# Altium schematic sheet Myproject.SchDoc
size A2; SheetNumber: 1; SheetTotal: 1
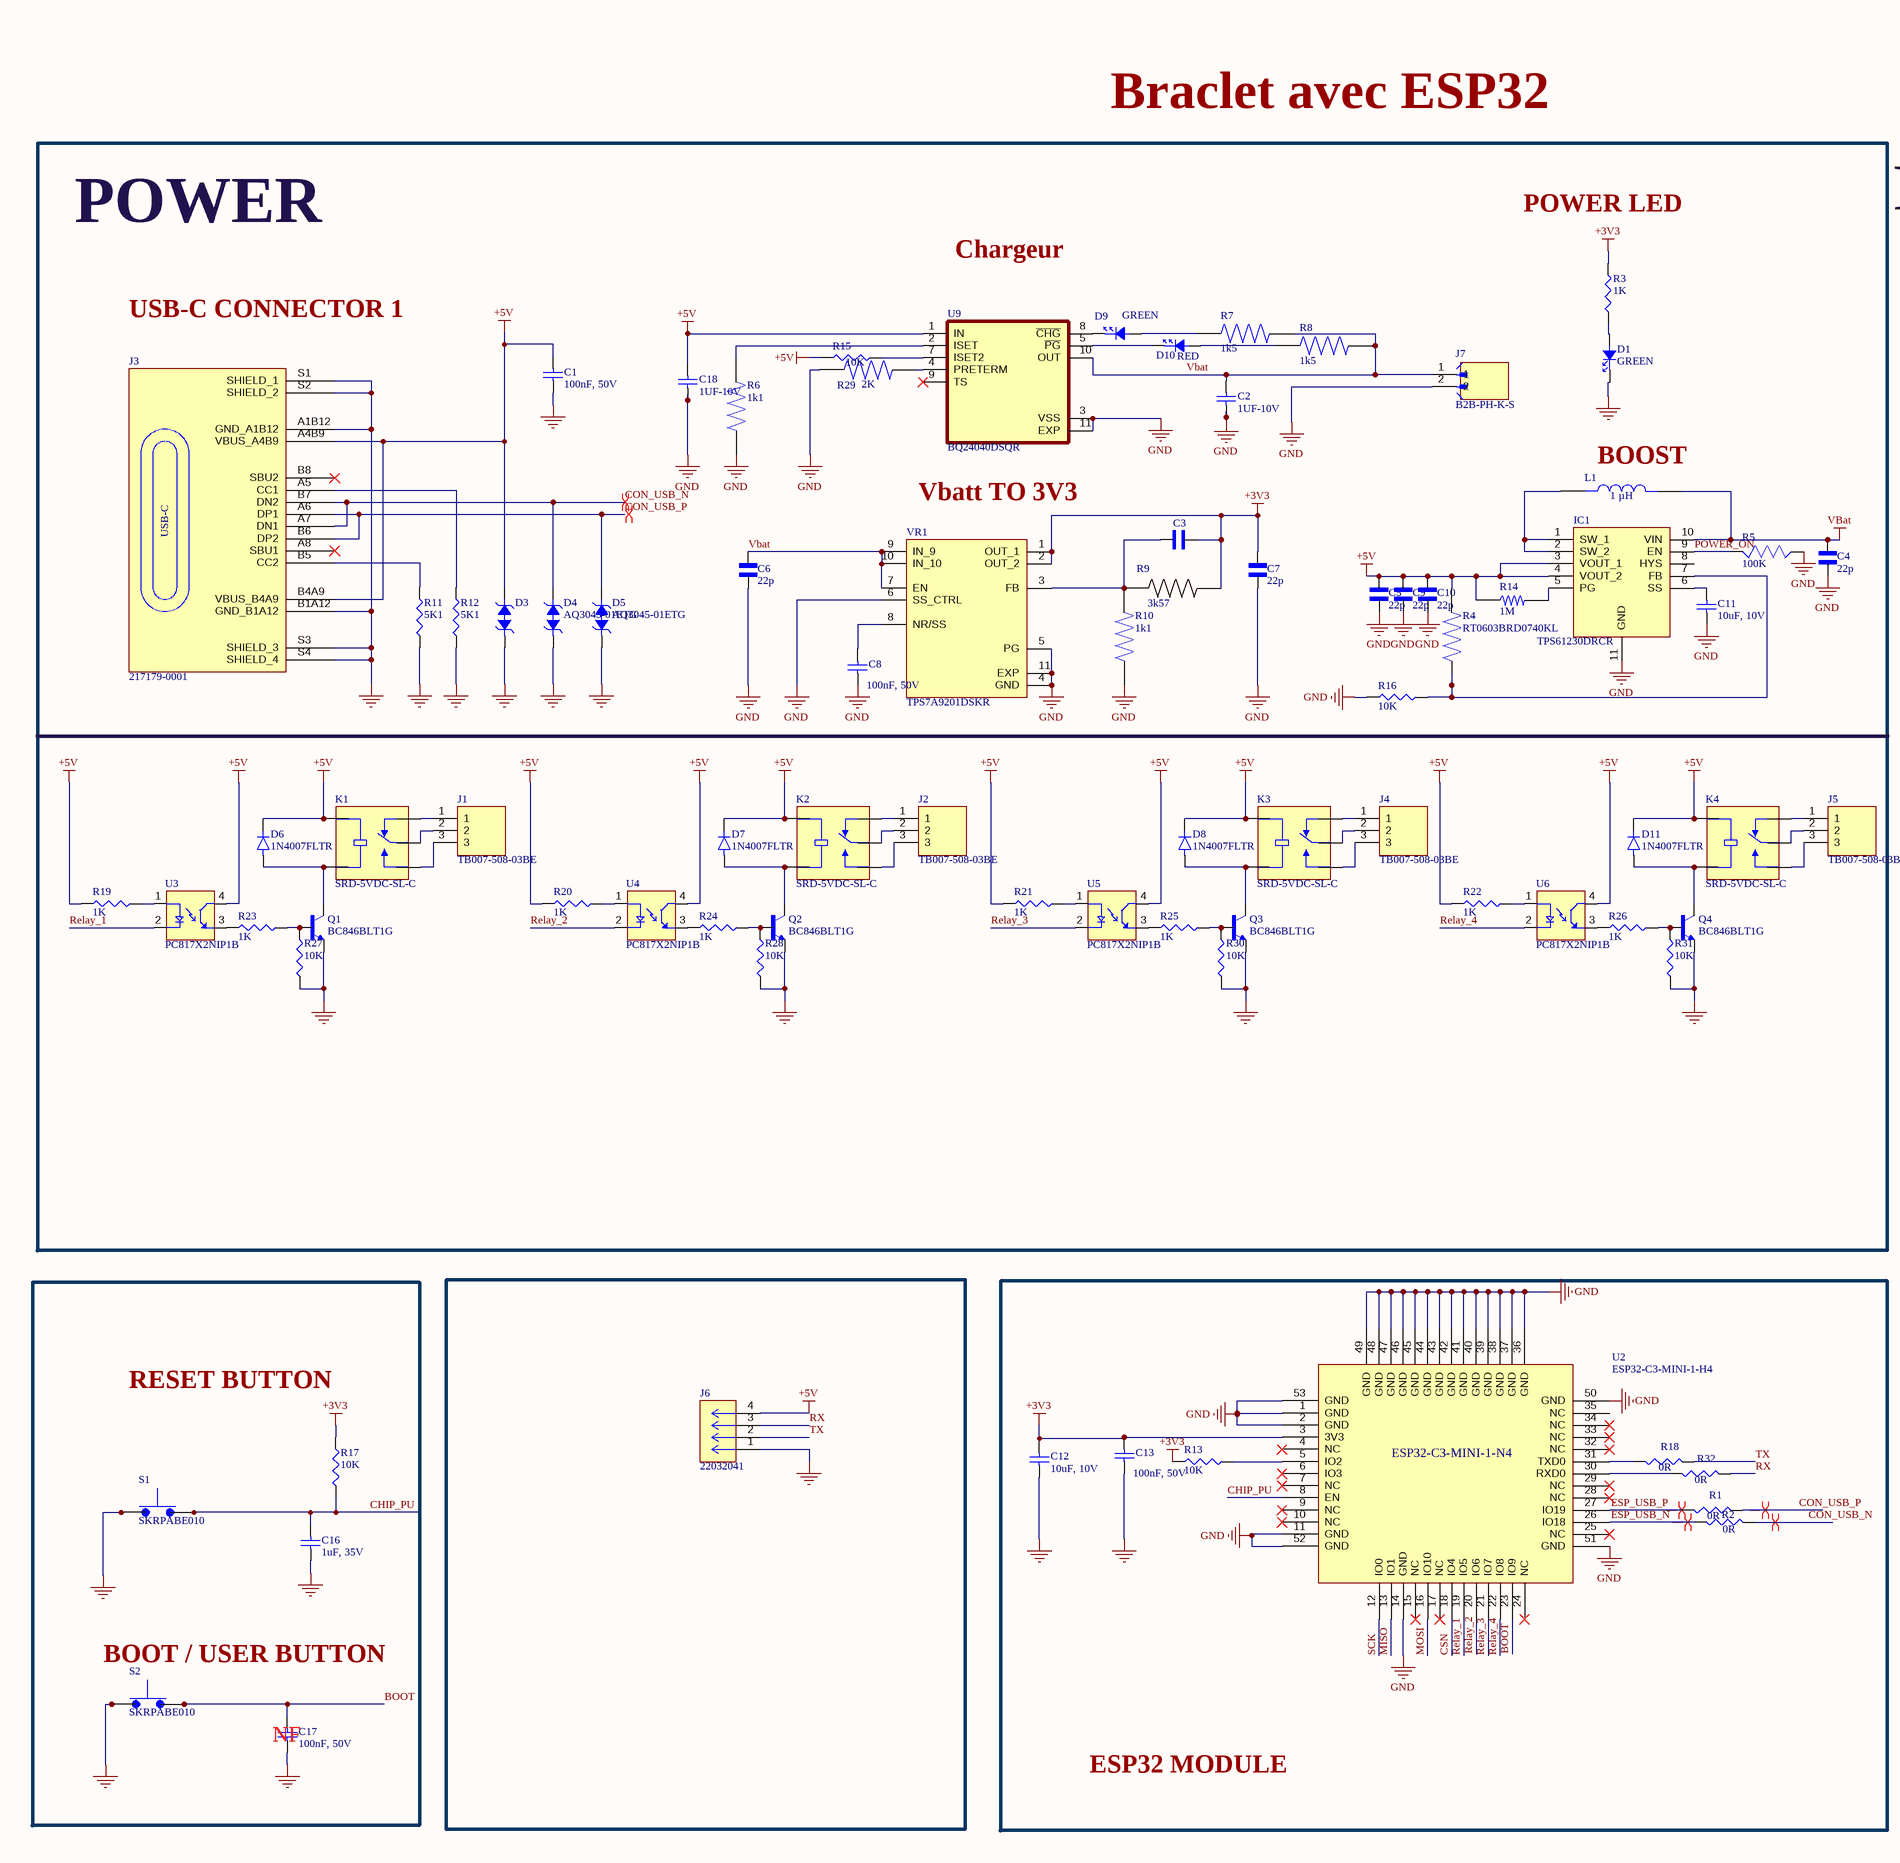
[diagram p0: Myproject.SchDoc, left]
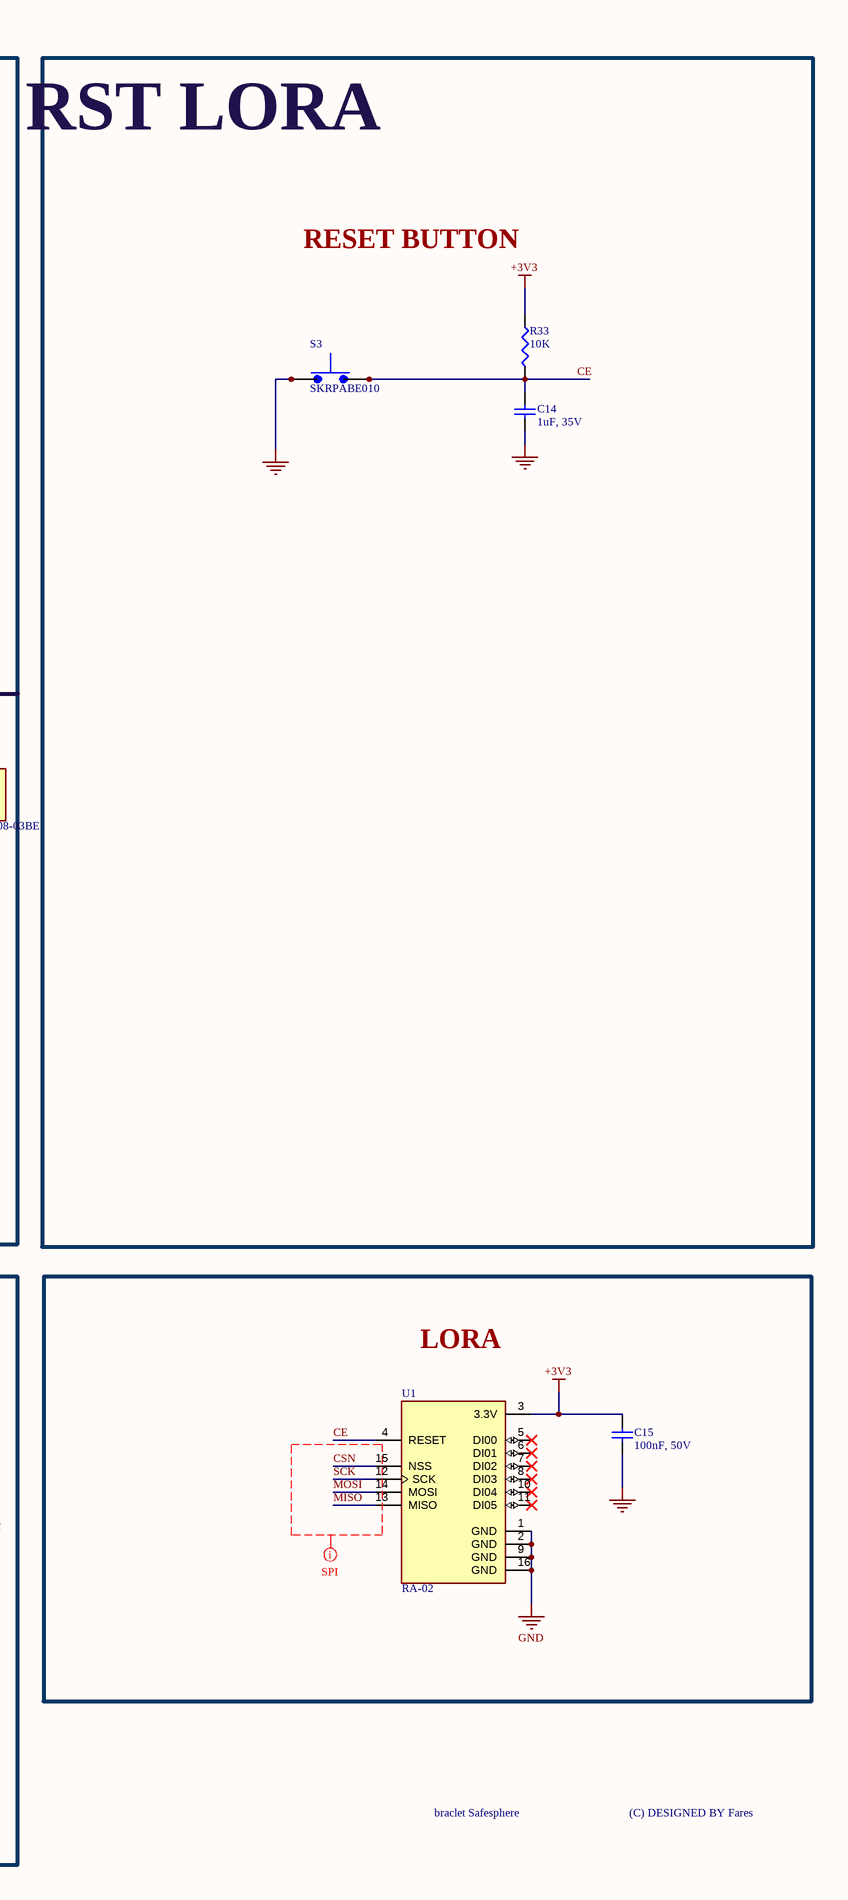
[diagram p1: Myproject.SchDoc, right]

## Parts
C1  100nF, 50V  [CAPC1005X55N]
C2  1UF-10V  [C0402]
C3  C0402C103K5REC7411  [CAPC1005X55N]  (value not drawn)
C4  value 22p  [CAPC1005X55N]  (hidden comment: CC0402JRNPO9BN220)
C5  value 22p  [CAPC1005X55N]  (hidden comment: CC0402JRNPO9BN220)
C6  value 22p  [CAPC1005X55N]  (hidden comment: CC0402JRNPO9BN220)
C7  value 22p  [CAPC1005X55N]  (hidden comment: CC0402JRNPO9BN220)
C8  100nF, 50V  [CAPC1005X55N]
C9  value 22p  [CAPC1005X55N]  (hidden comment: CC0402JRNPO9BN220)
C10  value 22p  [CAPC1005X55N]  (hidden comment: CC0402JRNPO9BN220)
C11  10uF, 10V  [CAPC1005X55N]
C12  10uF, 10V  [CAPC1005X55N]
C13  100nF, 50V  [CAPC1005X55N]
C14  1uF, 35V  [CAPC1005X55N]
C15  100nF, 50V  [CAPC1005X55N]
C16  1uF, 35V  [CAPC1005X55N]
C17  100nF, 50V  [CAPC1005X55N]
C18  1UF-10V  [C0402]
D1  GREEN  [LED0402G]
D3  AQ3045-01ETG  [SOD882]  (value not drawn)
D4  AQ3045-01ETG  [SOD882]
D5  AQ3045-01ETG  [SOD882]
D6  1N4007FLTR  [SODFL3618X110N]
D7  1N4007FLTR  [SODFL3618X110N]
D8  1N4007FLTR  [SODFL3618X110N]
D9  GREEN  [LED0402G]
D10  RED  [LED0402R]
D11  1N4007FLTR  [SODFL3618X110N]
IC1  TPS61230DRCR  [SON50P300X300X100-11N-D]
J1  TB007-508-03BE  [CUI_TB007-508-03BE]
J2  TB007-508-03BE  [CUI_TB007-508-03BE]
J3  217179-0001  [FP-2171790001-MFG]
J4  TB007-508-03BE  [CUI_TB007-508-03BE]
J5  TB007-508-03BE  [CUI_TB007-508-03BE]
J6  22032041  [CONN_SD-4030-0001_04_MOL]
J7  B2B-PH-K-S  [JST_B2B-PH-K-S]
K1  SRD-5VDC-SL-C  [RELAY_SRD-12VDC-SL-C]
K2  SRD-5VDC-SL-C  [RELAY_SRD-12VDC-SL-C]
K3  SRD-5VDC-SL-C  [RELAY_SRD-12VDC-SL-C]
K4  SRD-5VDC-SL-C  [RELAY_SRD-12VDC-SL-C]
L1  value 1 µH  [IND_XFL4020-102MEC]  (hidden comment: XFL4020-102MEC)
Q1  BC846BLT1G  [SOT95P237X111-3N]
Q2  BC846BLT1G  [SOT95P237X111-3N]
Q3  BC846BLT1G  [SOT95P237X111-3N]
Q4  BC846BLT1G  [SOT95P237X111-3N]
R1  0R  [RESC1005X37N]
R2  0R  [RESC1005X37N]
R3  1K  [RESC1005X37N]
R4  RT0603BRD0740KL  [RESC1608X55N]
R5  value 100K  [RESC1005X40]  (hidden comment: RC0402FR-07100KL)
R6  value 1k1  [RESC1005X35N]  (hidden comment: RT0402FRE071K1L)
R7  value 1k5  [RESC1005X35N]  (hidden comment: RT0402BRD071K5L)
R8  value 1k5  [RESC1005X35N]  (hidden comment: RT0402BRD071K5L)
R9  value 3k57  [*RESC1005X35N]  (hidden comment: RT0402BRD073K57L)
R10  value 1k1  [RESC1005X35N]  (hidden comment: RT0402FRE071K1L)
R11  5K1  [RESC1005X37N]
R12  5K1  [RESC1005X37N]
R13  10K  [RESC1005X37N]
R14  value 1M  [RESC1607X60N]  (hidden comment: RC0603FR-071ML)
R15  10K  [RESC1005X37N]
R16  10K  [RESC1005X37N]
R17  10K  [RESC1005X37N]
R18  0R  [RESC1005X37N]
R19  1K  [RESC1005X37N]
R20  1K  [RESC1005X37N]
R21  1K  [RESC1005X37N]
R22  1K  [RESC1005X37N]
R23  1K  [RESC1005X37N]
R24  1K  [RESC1005X37N]
R25  1K  [RESC1005X37N]
R26  1K  [RESC1005X37N]
R27  10K  [RESC1005X37N]
R28  10K  [RESC1005X37N]
R29  value 2K  [RESC1005X35N]  (hidden comment: RT0402BRE072KL)
R30  10K  [RESC1005X37N]
R31  10K  [RESC1005X37N]
R32  0R  [RESC1005X37N]
R33  10K  [RESC1005X37N]
S1  SKRPABE010  [SW_SKRPABE010]
S2  SKRPABE010  [SW_SKRPABE010]
S3  SKRPABE010  [SW_SKRPABE010]
U1  RA-02  [RA-02]
U2  ESP32-C3-MINI-1-H4  [XCVR_ESP32-C3-MINI-1-N4]
U3  PC817X2NIP1B  [SOIC254P960X420-4N]
U4  PC817X2NIP1B  [SOIC254P960X420-4N]
U5  PC817X2NIP1B  [SOIC254P960X420-4N]
U6  PC817X2NIP1B  [SOIC254P960X420-4N]
U9  BQ24040DSQR  [SON40P200X200X80-11N]
VR1  TPS7A9201DSKR  [SON50P250X250X80-11N]

## Blocks framed on the sheet
POWER: C1-C11 C18 D1 D3-D11 IC1 J1-J5 J7 K1-K4 L1 Q1-Q4 R3-R12 R14-R16 R19-R31 U3-U6 U9 VR1
RST LORA: C14 R33 S3
ESP32 MODULE: C12 C13 R1 R2 R13 R18 R32 U2
LORA: C15 U1

## Nets
+3V3: C3.2 C7.1 C12.2 C13.2 C15.2 R3.2 R9.2 R13.2 R17.2 R33.2 U1.3(3.3V) U2.3(3V3) VR1.1(OUT_1) VR1.2(OUT_2)
+5V: C1.2 C5.1 C9.1 C10.1 C18.1 D3.2 D6.1(K) D7.1(K) D8.1(K) D11.1(K) IC1.3(VOUT_1) IC1.4(VOUT_2) J3.A4B9(VBUS_A4B9) J3.B4A9(VBUS_B4A9) J6.4 K1.COIL1 K2.COIL1 K3.COIL1 K4.COIL1 R4.2 R14.1 R15.2 R19.2 R20.2 R21.2 R22.2 U3.4(CT) U4.4(CT) U5.4(CT) U6.4(CT) U9.1(IN)
GND: C1.1 C2.2 C4.2 C5.2 C6.2 C7.2 C8.1 C9.2 C10.2 C11.1 C12.1 C13.1 C14.1 C15.1 C16.1 C17.1 C18.2 D1.1 D3.1 D4.1 D5.1 IC1.11(GND) J3.A1B12(GND_A1B12) J3.B1A12(GND_B1A12) J3.S1(SHIELD_1) J3.S2(SHIELD_2) J3.S3(SHIELD_3) J3.S4(SHIELD_4) J6.1 J7.2 Q1.2(E) Q2.2(E) Q3.2(E) Q4.2(E) R5.2 R6.1 R10.1 R11.1 R12.1 R16.2 R27.1 R28.1 R29.1 R30.1 R31.1 S1.1 S1.2 S2.1 S2.2 S3.1 S3.2 U1.1(GND) U1.2(GND) U1.9(GND) U1.16(GND) U2.1(GND) U2.2(GND) U2.11(GND) U2.14(GND) U2.36(GND) U2.37(GND) U2.38(GND) U2.39(GND) U2.40(GND) U2.41(GND) U2.42(GND) U2.43(GND) U2.44(GND) U2.45(GND) U2.46(GND) U2.47(GND) U2.48(GND) U2.49(GND) U2.50(GND) U2.51(GND) U2.52(GND) U2.53(GND) U9.3(VSS) U9.11(EXP) VR1.4(GND) VR1.5(PG) VR1.6(SS_CTRL) VR1.11(EXP)
Vbat: C2.1 C4.1 C6.1 IC1.10(VIN) J7.1 L1.2 R7.2 R8.2 U9.10(OUT) VR1.7(EN) VR1.9(IN_9) VR1.10(IN_10)
BOOT: C17.2 S2.3 S2.4 U2.23(IO9)
CE: C14.2 R33.1 S3.3 S3.4 U1.4(RESET)
CHIP_PU: C16.2 R17.1 S1.3 S1.4 U2.8(EN)
CON_USB_N: D4.2 J3.A7(DN1) J3.B7(DN2) R2.1
CON_USB_P: D5.2 J3.A6(DP1) J3.B6(DP2) R1.1
CSN: U1.15(NSS) U2.18(IO4)
ESP_USB_N: R2.2 U2.26(IO18)
ESP_USB_P: R1.2 U2.27(IO19)
MISO: U1.13(MISO) U2.13(IO1)
MOSI: U1.14(MOSI) U2.16(IO10)
POWER_ON: IC1.9(EN) R5.1
Relay_1: U2.19(IO5) U3.2(C)
Relay_2: U2.20(IO6) U4.2(C)
Relay_3: U2.21(IO7) U5.2(C)
Relay_4: U2.22(IO8) U6.2(C)
RX: J6.3 R32.1
SCK: U1.12(SCK) U2.12(IO0)
TX: J6.2 R18.1
NetC3_1: C3.1 R9.1 R10.2 VR1.3(FB)
NetC8_2: C8.2 VR1.8(NR/SS)
NetC11_2: C11.2 IC1.6(SS)
NetD1_2: D1.2 R3.1
NetD6_2: D6.2(A) K1.COIL2 Q1.3(C)
NetD7_2: D7.2(A) K2.COIL2 Q2.3(C)
NetD8_2: D8.2(A) K3.COIL2 Q3.3(C)
NetD9_1: D9.1 U9.8(~{CHG})
NetD9_2: D9.2 R7.1
NetD10_1: D10.1 U9.5(~{PG})
NetD10_2: D10.2 R8.1
NetD11_2: D11.2(A) K4.COIL2 Q4.3(C)
NetIC1_1: IC1.1(SW_1) IC1.2(SW_2) L1.1
NetIC1_5: IC1.5(PG) R14.2
NetIC1_7: IC1.7(FB) R4.1 R16.1
NetJ1_1: J1.1 K1.NC
NetJ1_2: J1.2 K1.COM
NetJ1_3: J1.3 K1.NO
NetJ2_1: J2.1 K2.NC
NetJ2_2: J2.2 K2.COM
NetJ2_3: J2.3 K2.NO
NetJ3_A5: J3.A5(CC1) R12.2
NetJ3_B5: J3.B5(CC2) R11.2
NetJ4_1: J4.1 K3.NC
NetJ4_2: J4.2 K3.COM
NetJ4_3: J4.3 K3.NO
NetJ5_1: J5.1 K4.NC
NetJ5_2: J5.2 K4.COM
NetJ5_3: J5.3 K4.NO
NetQ1_1: Q1.1(B) R23.1 R27.2
NetQ2_1: Q2.1(B) R24.1 R28.2
NetQ3_1: Q3.1(B) R25.1 R30.2
NetQ4_1: Q4.1(B) R26.1 R31.2
NetR6_2: R6.2 U9.2(ISET)
NetR13_1: R13.1 U2.5(IO2)
NetR15_1: R15.1 U9.7(ISET2)
NetR18_2: R18.2 U2.31(TXD0)
NetR19_1: R19.1 U3.1(A)
NetR20_1: R20.1 U4.1(A)
NetR21_1: R21.1 U5.1(A)
NetR22_1: R22.1 U6.1(A)
NetR23_2: R23.2 U3.3(ET)
NetR24_2: R24.2 U4.3(ET)
NetR25_2: R25.2 U5.3(ET)
NetR26_2: R26.2 U6.3(ET)
NetR29_2: R29.2 U9.4(PRETERM)
NetR32_2: R32.2 U2.30(RXD0)

Not connected (* = marked no-connect by the designer): IC1 8(HYS); J3 A8(SBU1)* B8(SBU2)*; U1 5(DI00)* 6(DI01)* 7(DI02)* 8(DI03)* 10(DI04)* 11(DI05)*; U2 4(NC)* 6(IO3)* 7(NC)* 9(NC)* 10(NC)* 15(NC)* 17(NC)* 24(NC)* 25(NC)* 28(NC)* 29(NC)* 32(NC)* 33(NC)* 34(NC)* 35(NC); U9 9(TS)*

## Layout directives
differential pair; differential pair class DIFF90: CON_USB_N, CON_USB_P, ESP_USB_N, ESP_USB_P
net class SPI: CSN, MISO, MOSI, SCK

## Notes on the sheet
- Braclet avec ESP32
- POWER LED
- Chargeur
- USB-C CONNECTOR 1
- RESET BUTTON
- (near L1) BOOST
- Vbatt TO 3V3
- (near S2) BOOT / USER BUTTON
- (near C17) NF
- braclet Safesphere
- (C) DESIGNED BY Fares
- DWG NO:
- REV:
- THIS DOCUMENT AND THE DATA DISCLOSED HEREIN OR
- HEREWITH IS THE PROPERTY OF ALTIUM LIMITED AND MAY
- BE FREELY DISTRIBUTED IN WHOLE. NO RIGHTS ARE
- RESERVED OR EXPRESS OR IMPLIED WARANTEE GIVEN.
- REVISION
- DESCRIPTION
- DATE
- APPROVED
- ENG:
- APPROVALS
- PROJECT
- DSN:
- CHK:
- REFERENCE DOCUMENTS
- PROJECT REVISION:
- TITLE
- DOCUMENT REVISION:
- DESIGN ITEM:
- BOM:
- FAB DWG:
- PCB DWG:
- ASSY DWG:
- SCALE:
- A2
- SIZE
- CAGE CODE
- FILE NAME
- DWG NO.
- SHEET
- OF
- REV
- (in symbol 217179-0001) USB-C
- (in symbol ESP32-C3-MINI-1-H4) ESP32-C3-MINI-1-N4

## Library data of the parts
C1 C8 C13 C15 C17 = CL05B104KB54PNC: CAP CER 0.1UF 50V X7R 0402; Manufacturer: Samsung; Dielectric Material: Ceramic; Supplier: Digikey; Supplier Part Number: 1276-CL05B104KB54PNCCT-ND; Manufacturer Part Number: CL05B104KB54PNC; RoHS: Yes; Category: Ceramic Capacitors; Stock: 1237875; Pricing: 1=0.1, 10=0.044, 50=0.025, 100=0.0194, 500=0.0146, 1000=0.01147, 2500=0.01043, 5000=0.00959 (USD); Pins: 2; Capacitor Type: Ceramic; RoHS Compliant: Yes; Reach SVHC Compliant: Yes; ComponentLink1URL: https://datasheet.ciiva.com:443/pdfs/VipMasterIC/IC/SEMS/SEMS-S-A0006318249/SEMS-S-A0006320959-1.pdf?src-supplier=IHS+Markit; ComponentLink1Description: https://datasheet.ciiva.com:443/pdfs/VipMasterIC/IC/SEMS/SEMS-S-A0006318249/SEMS-S-A0006320959-1.pdf?src-supplier=IHS+Markit; ComponentLink2URL: https://datasheet.octopart.com/CL05B104KB54PNC-Samsung-datasheet-8326407.pdf?src-supplier=TME; ComponentLink2Description: https://datasheet.octopart.com/CL05B104KB54PNC-Samsung-datasheet-8326407.pdf?src-supplier=TME; LCSC Part Number: C307331
C2 C18 = CERAMIC-1UF-10V-10%-X5R(0402): 1 ÂµF Â±10% 10V Ceramic Capacitor X5R 0402 (1005 Metric); MF: Yageo; MP: CC0402KRX5R6BB105; SnapEDA_Link: https://www.snapeda.com/parts/CC0402KRX5R6BB105/Yageo/view-part/?ref=snap; Package: 1005 Taiyo Yuden; Value: *; Check_prices: https://www.snapeda.com/parts/CC0402KRX5R6BB105/Yageo/view-part/?ref=eda; LCSC Part Number: C106254
C3 = C0402C103K5REC7411: 10000 pF Â±10% 50V Ceramic Capacitor X7R 0402 (1005 Metric); MF: KEMET; SnapEDA_Link: https://www.snapeda.com/parts/C0402C103K5REC7411/KEMET/view-part/?ref=snap; Package: 1005 KEMET; Value: *; MP: C0402C103K5REC7411; Check_prices: https://www.snapeda.com/parts/C0402C103K5REC7411/KEMET/view-part/?ref=eda
C4-C7 C9 C10 = CC0402JRNPO9BN220: 22 pF Â±5% 50V Ceramic Capacitor C0G, NP0 0402 (1005 Metric); MF: Yageo; SnapEDA_Link: https://www.snapeda.com/parts/CC0402JRNPO9BN220/Yageo/view-part/?ref=snap; Package: 0402 Yageo; MP: CC0402JRNPO9BN220; Check_prices: https://www.snapeda.com/parts/CC0402JRNPO9BN220/Yageo/view-part/?ref=eda; LCSC Part Number: C106203
C11 C12 = CL05A106MP8NUB8: CAP CER 10UF 10V X5R 0402; Manufacturer: Samsung; Dielectric Material: Ceramic; Multilayer: Yes; Tolerance  (fill in as +-): 20%; Supplier: Digikey; Supplier Part Number: 1276-6830-1-ND; Manufacturer Part Number: CL05A106MP8NUB8; RoHS: Yes; Category: Ceramic Capacitors; Stock: 1294909; Pricing: 1=0.33, 10=0.215, 50=0.1584, 100=0.129, 500=0.1018, 1000=0.08597, 2500=0.08145 (USD); Mounting Technology: Surface Mount; Pins: 2; Package Shape: Rectangular; Case/Package: 0402; Terminal Finish: Nickel; Min Operating Temperature: -55°C; Max Operating Temperature: 85°C; JESD-609 Code: e3; Value: 10uF; Capacitor Type: Ceramic; Packaging: Tape and Reel; Tolerance (fill in as +-): 20%; Rated DC Voltage (URdc): 10V; Temperature Characteristics Code: X5R; Termination: Wraparound; Reach SVHC Compliant: Yes; RoHS Compliant: Yes; ComponentLink1URL: https://datasheet.ciiva.com:443/pdfs/VipMasterIC/IC/SEMS/SEMS-S-A0008521219/SEMS-S-A0008521325-1.pdf?src-supplier=IHS+Markit; ComponentLink1Description: https://datasheet.ciiva.com:443/pdfs/VipMasterIC/IC/SEMS/SEMS-S-A0008521219/SEMS-S-A0008521325-1.pdf?src-supplier=IHS+Markit; ComponentLink2URL: http://www.samsungsem.com/kr/support/product-search/mlcc/CL05A106MP8NUB8.jsp?src-supplier=Digikey; ComponentLink2Description: http://www.samsungsem.com/kr/support/product-search/mlcc/CL05A106MP8NUB8.jsp?src-supplier=Digikey; ComponentLink3URL: https://datasheet.octopart.com/CL05A106MP8NUB8-Samsung-Electro-Mechanics-datasheet-136460857.pdf?src-supplier=Future+Electronics; ComponentLink3Description: https://datasheet.octopart.com/CL05A106MP8NUB8-Samsung-Electro-Mechanics-datasheet-136460857.pdf?src-supplier=Future+Electronics; LCSC Part Number: C307415
C14 C16 = CL05A105KL5NRNC: CAP CER 1UF 35V X5R 0402; Manufacturer: Samsung; Dielectric Material: Ceramic; Multilayer: Yes; Tolerance  (fill in as +-): 10%; Supplier: Digikey; Supplier Part Number: 1276-6796-1-ND; Manufacturer Part Number: CL05A105KL5NRNC; RoHS: Yes; Category: Ceramic Capacitors; Stock: 469958; Pricing: 1=0.33, 10=0.212, 50=0.149, 100=0.1202, 500=0.08934, 1000=0.07818, 2500=0.07446, 5000=0.06887 (USD); Mounting Technology: Surface Mount; Pins: 2; Package Shape: Rectangular; Case/Package: 0402; Terminal Finish: Nickel; Min Operating Temperature: -55°C; Max Operating Temperature: 85°C; JESD-609 Code: e3; Value: 1uF; Capacitor Type: Ceramic; Packaging: Tape and Reel; Tolerance (fill in as +-): 10%; Rated DC Voltage (URdc): 35V; Temperature Characteristics Code: X5R; Termination: Wraparound; Reach SVHC Compliant: Yes; RoHS Compliant: Yes; ComponentLink1URL: https://datasheet.ciiva.com:443/pdfs/VipMasterIC/IC/SEMS/SEMS-S-A0008384515/SEMS-S-A0008872905-1.pdf?src-supplier=IHS+Markit; ComponentLink1Description: https://datasheet.ciiva.com:443/pdfs/VipMasterIC/IC/SEMS/SEMS-S-A0008384515/SEMS-S-A0008872905-1.pdf?src-supplier=IHS+Markit; ComponentLink2URL: http://www.samsungsem.com/kr/support/product-search/mlcc/CL05A105KL5NRNC.jsp?src-supplier=Digikey; ComponentLink2Description: http://www.samsungsem.com/kr/support/product-search/mlcc/CL05A105KL5NRNC.jsp?src-supplier=Digikey; LCSC Part Number: C307413
D1 D9 = VLMG1500-GS08: LED YLW-GRN 0402 SMD; Manufacturer: Vishay; Color: Green,Yellow; Lens Color: Clear; Viewing Angle: 130°; Forward Current: 30mA; Forward Voltage: 2V; Luminous Intensity: 35mcd; Dominant Wavelength: 571nm; Test Current: 20mA; Number of Elements: 1; Power Dissipation: 75mW; Lens Style: Rectangular; Reverse Voltage: 5V; Supplier: Digikey; Supplier Part Number: VLMG1500-GS08CT-ND; Manufacturer Part Number: VLMG1500-GS08; RoHS: Yes; Category: LEDs; Stock: 98; Pricing: 1=0.34, 10=0.265, 100=0.119, 500=0.10746, 1000=0.08827 (USD); Mounting Technology: Surface Mount; Case/Package: 0402; Pins: 2; Case Code (Metric): 1005; Case Code (Imperial): 0402; Min Operating Temperature: -30°C; Max Operating Temperature: 85°C; Package Quantity: 1; Packaging: Tape and Reel; Illumination Color: Green; Wavelength: 571nm; Number of LEDs: 1; Power Rating: 75mW; Series: CHipLED; Length: 1mm; Width: 0.5mm; Height: 0.35mm; Depth: 0.5mm; Radiation Hardening: No; Lead Free: Lead Free; RoHS Compliant: Yes; Reach SVHC Compliant: Unknown; ComponentLink1URL: https://datasheet.ciiva.com/12071/vlmo1500-244705-12071911.pdf?src-supplier=Mouser; ComponentLink1Description: https://datasheet.ciiva.com/12071/vlmo1500-244705-12071911.pdf?src-supplier=Mouser; ComponentLink2URL: https://datasheet.ciiva.com/30005/vlmo1500-30005134.pdf?src-supplier=Avnet; ComponentLink2Description: https://datasheet.ciiva.com/30005/vlmo1500-30005134.pdf?src-supplier=Avnet; LCSC Part Number: C511404
D3-D5 = AQ3045-01ETG: TVS DIODE 5.3VWM 12VC SOD882; Manufacturer: Littelfuse; Diode Element Material: SILICON; Package Body Material: Plastic; Polarity: Bidirectional; Max Breakdown Voltage: 9V; Min Breakdown Voltage: 6.8V; Diode Type: TRANS VOLTAGE SUPPRESSOR; Non-rep Peak Rev Power Dis-Max: 40W; Number of Elements: 1; Rep Pk Reverse Voltage-Max: 5.3V; Reference Standard: AEC-Q101; Supplier: Digikey; Supplier Part Number: F9321CT-ND; Manufacturer Part Number: AQ3045-01ETG; RoHS: Yes; Category: TVS Diodes; Stock: 21664; Pricing: 1=0.5, 10=0.391, 100=0.2344, 500=0.217, 1000=0.14756, 2000=0.13585, 5000=0.1302 (USD); Pins: 2; Package Shape: Rectangular; Min Operating Temperature: -55°C; Max Operating Temperature: 150°C; Package Style: CHIP CARRIERMeter; Surface Mount: Yes; Technology: AVALANCHE; Terminal Form: No Lead; Terminal Position: BOTTOM; Reach SVHC Compliant: Yes; RoHS Compliant: Yes; ComponentLink1URL: https://datasheet.ciiva.com:443/pdfs/VipMasterIC/IC/LFSI/LFSI-S-A0007892042/LFSI-S-A0007892042-1.pdf?src-supplier=IHS+Markit; ComponentLink1Description: https://datasheet.ciiva.com:443/pdfs/VipMasterIC/IC/LFSI/LFSI-S-A0007892042/LFSI-S-A0007892042-1.pdf?src-supplier=IHS+Markit; ComponentLink2URL: https://www.littelfuse.com/~/media/electronics/datasheets/tvs_diode_arrays/littelfuse_tvs_diode_array_aq3045_datasheet.pdf.pdf?src-supplier=Digikey; ComponentLink2Description: https://www.littelfuse.com/~/media/electronics/datasheets/tvs_diode_arrays/littelfuse_tvs_diode_array_aq3045_datasheet.pdf.pdf?src-supplier=Digikey; ComponentLink3URL: http://www.littelfuse.com/~/media/electronics/datasheets/tvs_diode_arrays/littelfuse_tvs_diode_array_aq3045_datasheet.pdf.pdf?src-supplier=Digikey; ComponentLink3Description: http://www.littelfuse.com/~/media/electronics/datasheets/tvs_diode_arrays/littelfuse_tvs_diode_array_aq3045_datasheet.pdf.pdf?src-supplier=Digikey; LCSC Part Number: C3710326
D10 = VLMS1500-GS08: LED RED 0402 SMD; Manufacturer: Vishay; Shape: Rectangular; Forward Current: 30mA; Forward Voltage: 2.4V; Luminous Intensity-Nom: 54mcd; Channels: 1; Optoelectronic Device Type: SINGLE COLOR LED; Reverse Voltage-Max: 5V; Viewing Angle: 130°; Overall Height: 0.35mm; Supplier: Digikey; Supplier Part Number: VLMS1500-GS08CT-ND; Manufacturer Part Number: VLMS1500-GS08; RoHS: Yes; Category: LEDs; Stock: 70376; Pricing: 1=0.34, 10=0.265, 100=0.119, 500=0.10746, 1000=0.08827 (USD); Mounting Technology: Surface Mount; Pins: 2; Color: Red; Color@wavelength: Red; Min Operating Temperature: -30°C; Max Operating Temperature: 85°C; Packaging: Tape and Reel; Size: 0.5mm; Terminal Pitch: 0.95mm; Reach SVHC Compliant: Yes; RoHS Compliant: Yes; ComponentLink1URL: https://datasheet.ciiva.com:443/pdfs/VipMasterIC/IC/VISH/VISH-S-A0003457490/VISH-S-A0003457490-1.pdf?src-supplier=IHS+Markit; ComponentLink1Description: https://datasheet.ciiva.com:443/pdfs/VipMasterIC/IC/VISH/VISH-S-A0003457490/VISH-S-A0003457490-1.pdf?src-supplier=IHS+Markit; ComponentLink2URL: http://www.farnell.com/datasheets/1809983.pdf?src-supplier=Farnell; ComponentLink2Description: http://www.farnell.com/datasheets/1809983.pdf?src-supplier=Farnell; ComponentLink3URL: http://www.mouser.com/ds/2/427/vlmo1500-244705.pdf?src-supplier=Mouser; ComponentLink3Description: http://www.mouser.com/ds/2/427/vlmo1500-244705.pdf?src-supplier=Mouser; ComponentLink4URL: https://datasheet.octopart.com/VLMS1500-GS08-Vishay-datasheet-62332426.pdf?src-supplier=Newark; ComponentLink4Description: https://datasheet.octopart.com/VLMS1500-GS08-Vishay-datasheet-62332426.pdf?src-supplier=Newark; ComponentLink5URL: https://datasheet.octopart.com/VLMS1500-GS08-Vishay-datasheet-33014519.pdf?src-supplier=Element14; ComponentLink5Description: https://datasheet.octopart.com/VLMS1500-GS08-Vishay-datasheet-33014519.pdf?src-supplier=Element14; ComponentLink6URL: http://datasheet.octopart.com/VLMS1500-GS08-Vishay-datasheet-21227148.pdf?src-supplier=Avnet; ComponentLink6Description: http://datasheet.octopart.com/VLMS1500-GS08-Vishay-datasheet-21227148.pdf?src-supplier=Avnet; ComponentLink7URL: http://www.farnell.com/datasheets/1809983.pdf?src-supplier=Newark; ComponentLink7Description: http://www.farnell.com/datasheets/1809983.pdf?src-supplier=Newark; ComponentLink8URL: http://www.farnell.com/datasheets/2050839.pdf?src-supplier=Newark; ComponentLink8Description: http://www.farnell.com/datasheets/2050839.pdf?src-supplier=Newark; ComponentLink9URL: http://datasheet.octopart.com/VLMS1500-GS08-Vishay-datasheet-21227148.pdf?src-supplier=Quest; ComponentLink9Description: http://datasheet.octopart.com/VLMS1500-GS08-Vishay-datasheet-21227148.pdf?src-supplier=Quest; ComponentLink10URL: http://datasheet.octopart.com/VLMS1500-GS08-Vishay-datasheet-21227148.pdf?src-supplier=NAC+Semi; ComponentLink10Description: http://datasheet.octopart.com/VLMS1500-GS08-Vishay-datasheet-21227148.pdf?src-supplier=NAC+Semi; LCSC Part Number: C511370
IC1 = TPS61230DRCR: Integrated Circuit; Manufacturer_Name: Texas Instruments; Datasheet Link: http://www.ti.com/lit/gpn/tps61230; Height: 1mm; Manufacturer_Part_Number: TPS61230DRCR; Mouser Part Number: 595-TPS61230DRCR; Mouser Price/Stock: https://www.mouser.co.uk/ProductDetail/Texas-Instruments/TPS61230DRCR?qs=p08Uhw9w2Fyn7hRbmC7n5A%3D%3D; Arrow Part Number: TPS61230DRCR; Arrow Price/Stock: https://www.arrow.com/en/products/tps61230drcr/texas-instruments?utm_currency=USD&region=nac; LCSC Part Number: C139626
J1 J2 J4 J5 = TB007-508-03BE: 2~24 Poles, Screw Type, Horizontal, 5.08 Pitch, 24~12 (AWG), Terminal Block Connector; MF: Same Sky; SnapEDA_Link: https://www.snapeda.com/parts/TB007-508-03BE/Same+Sky/view-part/?ref=snap; Package: None; Value: *; MP: TB007-508-03BE; Check_prices: https://www.snapeda.com/parts/TB007-508-03BE/Same+Sky/view-part/?ref=eda
J3 = 217179-0001: CONN RCP USB2.0 TYP C 24P SMD RA; Manufacturer: Molex; Supplier: Digikey; Supplier Part Number: 900-2171790001CT-ND; Manufacturer Part Number: 217179-0001; RoHS: No; Category: Connectors; Stock: 7228; Pricing: 1=0.9, 10=0.745, 100=0.6212 (USD); LCSC Part Number: C3197684
J6 = 22032041: KK 254 Wire to Board Header, Single Row, Vertical, 4 Circuits | Molex Incorporated 22-03-2041; SnapEDA_Link: https://www.snapeda.com/parts/22-03-2041/Molex/view-part/?ref=snap; Package: None; Value: *; MF: Molex; MP: 22-03-2041; Check_prices: https://www.snapeda.com/parts/22-03-2041/Molex/view-part/?ref=eda
J7 = B2B-PH-K-S: Connector Header Through Hole 2 position 0.079 (2.00mm); MF: JST Sales America Inc.; SnapEDA_Link: https://www.snapeda.com/parts/B2B-PH-K-S/JST/view-part/?ref=snap; Package: None; Value: *; MP: B2B-PH-K-S; Check_prices: https://www.snapeda.com/parts/B2B-PH-K-S/JST/view-part/?ref=eda; LCSC Part Number: C131337
K1-K4 = SRD-5VDC-SL-C: General Purpose Non Latching 5VDC SPDT Through Hole Relays RoHS; MF: Songle Relay; MP: SRD-12VDC-SL-C; SnapEDA_Link: https://www.snapeda.com/parts/SRD-12VDC-SL-C/Songle+Relay/view-part/?ref=snap; Package: NON STANDARD-5 Songle Relay; Value: *; Check_prices: https://www.snapeda.com/parts/SRD-12VDC-SL-C/Songle+Relay/view-part/?ref=eda
L1 = XFL4020-102MEC: 1 ÂµH Shielded Molded Inductor 11 A 11.9mOhm Max 1616 (4040 Metric); MF: Coilcraft; SnapEDA_Link: https://www.snapeda.com/parts/XFL4020-102MEC/Coilcraft/view-part/?ref=snap; Package: None; MP: XFL4020-102MEC; Check_prices: https://www.snapeda.com/parts/XFL4020-102MEC/Coilcraft/view-part/?ref=eda; LCSC Part Number: C5355380
Q1-Q4 = BC846BLT1G: Bipolar (BJT) Transistor NPN 65 V 100 mA 100MHz 300 mW Surface Mount SOT-23-3 (TO-236); MF: ON Semiconductor; SnapEDA_Link: https://www.snapeda.com/parts/BC846BLT1G/Onsemi/view-part/?ref=snap; Package: SOT-23-3 ON Semiconductor; Value: *; MP: BC846BLT1G; Check_prices: https://www.snapeda.com/parts/BC846BLT1G/Onsemi/view-part/?ref=eda
R1 R2 R18 R32 = RC0402JR-070RL: RES 0 OHM JUMPER 1/16W 0402; Manufacturer: Yageo; Power: 62.5mW; Rated Temperature: 70°C; Package Height: 0.35mm; Package Length: 1mm; Package Width: 0.5mm; Supplier: Digikey; Supplier Part Number: 311-0.0JRCT-ND; Manufacturer Part Number: RC0402JR-070RL; RoHS: Yes; Category: Chip SMD Resistors; Stock: 5988729; Pricing: 1=0.1, 10=0.011, 25=0.0084, 50=0.0064, 100=0.0045, 250=0.00364, 500=0.0029, 1000=0.00214, 5000=0.00154 (USD); Mounting Technology: Surface Mount; Pins: 2; Package Shape: Rectangular; Case/Package: 0402; Terminal Finish: Nickel; Min Operating Temperature: -55°C; Max Operating Temperature: 155°C; JESD-609 Code: e3; Resistor Type: FIXED RESISTOR; Construction: Chip; Package Style: SMTMeter; Packaging: Tape and Reel; Value: 0R; Technology: METAL GLAZE/THICK FILM; Termination: Wraparound; Reach SVHC Compliant: Yes; RoHS Compliant: Yes; ComponentLink1URL: https://datasheet.ciiva.com:443/pdfs/VipMasterIC/IC/YAGO/YAGO-S-A0008145938/YAGO-S-A0008145938-1.pdf?src-supplier=IHS+Markit; ComponentLink1Description: https://datasheet.ciiva.com:443/pdfs/VipMasterIC/IC/YAGO/YAGO-S-A0008145938/YAGO-S-A0008145938-1.pdf?src-supplier=IHS+Markit; LCSC Part Number: C60485
R3 R19-R26 = RC0402FR-071KL: RES 1K OHM 1% 1/16W 0402; Manufacturer: Yageo; Additional Feature: LASER TRIMMABLE; Power: 62.5mW; Rated Temperature: 70°C; Value: 1kR; Temperature Coefficient: 100ppm/°C; Working Voltage: 50V; Package Height: 0.35mm; Package Length: 1mm; Package Width: 0.5mm; Supplier: Digikey; Supplier Part Number: 311-1.00KLRCT-ND; Manufacturer Part Number: RC0402FR-071KL; RoHS: Yes; Category: Chip SMD Resistors; Stock: 11967525; Pricing: 1=0.1, 10=0.015, 50=0.0088, 100=0.0073, 500=0.00488, 1000=0.00417, 5000=0.00297 (USD); Mounting Technology: Surface Mount; Pins: 2; Package Shape: Rectangular; Case/Package: 0402; Terminal Finish: Nickel; Min Operating Temperature: -55°C; Max Operating Temperature: 155°C; Tolerance: 1%; JESD-609 Code: e3; Resistor Type: FIXED RESISTOR; Construction: Chip; Package Style: SMTMeter; Packaging: Tape and Reel; Technology: METAL GLAZE/THICK FILM; Termination: Wraparound; Reach SVHC Compliant: Yes; RoHS Compliant: Yes; ComponentLink1URL: https://datasheet.ciiva.com:443/pdfs/VipMasterIC/IC/YAGO/YAGO-S-A0008145938/YAGO-S-A0008145938-1.pdf?src-supplier=IHS+Markit; ComponentLink1Description: https://datasheet.ciiva.com:443/pdfs/VipMasterIC/IC/YAGO/YAGO-S-A0008145938/YAGO-S-A0008145938-1.pdf?src-supplier=IHS+Markit; ComponentLink2URL: https://datasheet.ciiva.com/11819/0900766b80c66297-11819477.pdf?src-supplier=Rs; ComponentLink2Description: https://datasheet.ciiva.com/11819/0900766b80c66297-11819477.pdf?src-supplier=Rs; ComponentLink3URL: https://datasheet.ciiva.com/22747/1018594-22747513.pdf?src-supplier=Element14; ComponentLink3Description: https://datasheet.ciiva.com/22747/1018594-22747513.pdf?src-supplier=Element14; ComponentLink4URL: https://datasheet.ciiva.com/12666/pyu-rc0402-51-rohs-l-6-r-12666741.pdf?src-supplier=Mouser; ComponentLink4Description: https://datasheet.ciiva.com/12666/pyu-rc0402-51-rohs-l-6-r-12666741.pdf?src-supplier=Mouser; ComponentLink5URL: https://datasheet.ciiva.com/17063/pyu-rc0402-51-rohs-l-6-r-17063193.pdf?src-supplier=Future+Electronics; ComponentLink5Description: https://datasheet.ciiva.com/17063/pyu-rc0402-51-rohs-l-6-r-17063193.pdf?src-supplier=Future+Electronics; ComponentLink6URL: https://datasheet.ciiva.com/7983/1018594-7983502.pdf?src-supplier=Element14; ComponentLink6Description: https://datasheet.ciiva.com/7983/1018594-7983502.pdf?src-supplier=Element14; ComponentLink7URL: https://datasheet.ciiva.com/7849/1018594-7849869.pdf?src-supplier=Element14; ComponentLink7Description: https://datasheet.ciiva.com/7849/1018594-7849869.pdf?src-supplier=Element14; ComponentLink8URL: https://datasheet.ciiva.com/7849/1018594-7849871.pdf?src-supplier=Element14; ComponentLink8Description: https://datasheet.ciiva.com/7849/1018594-7849871.pdf?src-supplier=Element14; LCSC Part Number: C106235
R4 = RT0603BRD0740KL: 40 kOhms Â±0.1% 0.1W, 1/10W Chip Resistor 0603 (1608 Metric) - Thin Film; MF: Yageo; SnapEDA_Link: https://www.snapeda.com/parts/RT0603BRD0740KL/Yageo/view-part/?ref=snap; Package: 1608 Yageo; Value: *; MP: RT0603BRD0740KL; Check_prices: https://www.snapeda.com/parts/RT0603BRD0740KL/Yageo/view-part/?ref=eda
R5 = RC0402FR-07100KL: 100 kOhms Â±1% 0.063W, 1/16W Chip Resistor 0402 (1005 Metric) Moisture Resistant Thick Film; MF: Yageo; SnapEDA_Link: https://www.snapeda.com/parts/RC0402FR-07100KL/Yageo/view-part/?ref=snap; Package: 0402 Yageo; MP: RC0402FR-07100KL; Check_prices: https://www.snapeda.com/parts/RC0402FR-07100KL/Yageo/view-part/?ref=eda; LCSC Part Number: C60491
R6 R10 = RT0402FRE071K1L: Res Thin Film 0402 1.1K Ohm 1% 0.063W(1/16W) Â±50ppm/C Molded SMD Paper T/R; MF: Yageo; SnapEDA_Link: https://www.snapeda.com/parts/RT0402FRE071K1L/Yageo/view-part/?ref=snap; Package: 1005 Yageo; MP: RT0402FRE071K1L; Check_prices: https://www.snapeda.com/parts/RT0402FRE071K1L/Yageo/view-part/?ref=eda; LCSC Part Number: C138041
R7 R8 = RT0402BRD071K5L: 1.5 kOhms Â±0.1% 0.063W, 1/16W Chip Resistor 0402 (1005 Metric) - Thin Film; MF: Yageo; SnapEDA_Link: https://www.snapeda.com/parts/RT0402BRD071K5L/Yageo/view-part/?ref=snap; Package: 1005 Yageo; MP: RT0402BRD071K5L; Check_prices: https://www.snapeda.com/parts/RT0402BRD071K5L/Yageo/view-part/?ref=eda; LCSC Part Number: C281775
R11 R12 = AC0402FR-075K1L: RES SMD 5.1K OHM 1% 1/16W 0402; Manufacturer: Yageo; Additional Feature: LASER TRIMMABLE; Power: 62.5mW; Rated Temperature: 70°C; Value: 5.1kR; Temperature Coefficient: 100ppm/°C; Working Voltage: 50V; Package Height: 0.32mm; Package Length: 1mm; Package Width: 0.5mm; Reference Standard: AEC-Q200; Supplier: Digikey; Supplier Part Number: YAG3503CT-ND; Manufacturer Part Number: AC0402FR-075K1L; RoHS: Yes; Category: Chip SMD Resistors; Stock: 164969; Pricing: 1=0.1, 10=0.019, 50=0.0116, 100=0.0095, 500=0.00638, 1000=0.00544, 5000=0.00391 (USD); Mounting Technology: Surface Mount; Pins: 2; Package Shape: Rectangular; Case/Package: 0402; Terminal Finish: Nickel; Min Operating Temperature: -55°C; Max Operating Temperature: 155°C; Tolerance: 1%; JESD-609 Code: e3; Resistor Type: FIXED RESISTOR; Construction: Chip; Package Style: SMTMeter; Packaging: Tape and Reel; Technology: METAL GLAZE/THICK FILM; Termination: Wraparound; Reach SVHC Compliant: Yes; RoHS Compliant: Yes; ComponentLink1URL: https://datasheet.ciiva.com:443/pdfs/VipMasterIC/IC/YAGO/YAGO-S-A0003597364/YAGO-S-A0003597364-1.pdf?src-supplier=IHS+Markit; ComponentLink1Description: https://datasheet.ciiva.com:443/pdfs/VipMasterIC/IC/YAGO/YAGO-S-A0003597364/YAGO-S-A0003597364-1.pdf?src-supplier=IHS+Markit; ComponentLink2URL: https://datasheet.octopart.com/AC0402FR-075K1L-Yageo-datasheet-166720450.pdf?src-supplier=Future+Electronics; ComponentLink2Description: https://datasheet.octopart.com/AC0402FR-075K1L-Yageo-datasheet-166720450.pdf?src-supplier=Future+Electronics; ComponentLink3URL: http://www.yageo.com/documents/recent/PYu-AC_51_RoHS_L_2_revised.pdf?src-supplier=Future+Electronics; ComponentLink3Description: http://www.yageo.com/documents/recent/PYu-AC_51_RoHS_L_2_revised.pdf?src-supplier=Future+Electronics; LCSC Part Number: C144745
R13 R15-R17 R27 R28 R30 R31 R33 = AC0402FR-0710KL: RES SMD 10K OHM 1% 1/16W 0402; Manufacturer: Yageo; Additional Feature: LASER TRIMMABLE; Power: 62.5mW; Rated Temperature: 70°C; Value: 10kR; Temperature Coefficient: 100ppm/°C; Working Voltage: 50V; Package Height: 0.32mm; Package Length: 1mm; Package Width: 0.5mm; Reference Standard: AEC-Q200; Supplier: Digikey; Supplier Part Number: YAG3436CT-ND; Manufacturer Part Number: AC0402FR-0710KL; RoHS: Yes; Category: Chip SMD Resistors; Stock: 1122213; Pricing: 1=0.1, 10=0.019, 50=0.0116, 100=0.0095, 500=0.00638, 1000=0.00544, 5000=0.00391 (USD); Mounting Technology: Surface Mount; Pins: 2; Package Shape: Rectangular; Case/Package: 0402; Terminal Finish: Nickel; Min Operating Temperature: -55°C; Max Operating Temperature: 155°C; Tolerance: 1%; JESD-609 Code: e3; Resistor Type: FIXED RESISTOR; Construction: Chip; Package Style: SMTMeter; Packaging: Tape and Reel; Technology: METAL GLAZE/THICK FILM; Termination: Wraparound; Reach SVHC Compliant: Yes; RoHS Compliant: Yes; ComponentLink1URL: https://datasheet.ciiva.com:443/pdfs/VipMasterIC/IC/YAGO/YAGO-S-A0003597364/YAGO-S-A0003597364-1.pdf?src-supplier=IHS+Markit; ComponentLink1Description: https://datasheet.ciiva.com:443/pdfs/VipMasterIC/IC/YAGO/YAGO-S-A0003597364/YAGO-S-A0003597364-1.pdf?src-supplier=IHS+Markit; ComponentLink2URL: https://datasheet.ciiva.com/12656/pyu-ac-51-rohs-l-2-12656634.pdf?src-supplier=Mouser; ComponentLink2Description: https://datasheet.ciiva.com/12656/pyu-ac-51-rohs-l-2-12656634.pdf?src-supplier=Mouser; LCSC Part Number: C144807
R14 = RC0603FR-071ML: Thick film general purpose; MF: {'manufacturer': u'YAGEO'}; Package: None; Price: None; MP: RC0603FR-071ML; Availability: Unavailable; LCSC Part Number: C105578
R29 = RT0402BRE072KL: 2 kOhms Â±0.1% 0.063W, 1/16W Chip Resistor 0402 (1005 Metric) - Thin Film; MF: Yageo; SnapEDA_Link: https://www.snapeda.com/parts/RT0402BRE072KL/Yageo/view-part/?ref=snap; Digi-Key_Part_Number: YAG4370TR-ND; Check_prices: https://www.snapeda.com/parts/RT0402BRE072KL/Yageo/view-part/?ref=eda; MP: RT0402BRE072KL; Package: 1005 Yageo; Purchase-URL: https://pricing.snapeda.com/search/part/RT0402BRE072KL/?ref=eda; LCSC Part Number: C513635
S1-S3 = SKRPABE010: Switch Tactile N.O. SPST Button J-Bend 0.05A 16VDC 1.57N SMD Automotive T/R; MF: ALPS; SnapEDA_Link: https://www.snapeda.com/parts/SKRPABE010/ALPS/view-part/?ref=snap; Package: None; Value: *; MP: SKRPABE010; Check_prices: https://www.snapeda.com/parts/SKRPABE010/ALPS/view-part/?ref=eda
  S1 S3: LCSC part number: C115360
  S2: LCSC Part Number: C115360
U1 = RA-02: General ISM < 1GHz LoRaâ„¢ Transceiver Module 410MHz ~ 525MHz Antenna Not Included, I-PEX Surface Mount; MF: Ai-Thinker; SnapEDA_Link: https://www.snapeda.com/parts/RA-02/AI-Thinker/view-part/?ref=snap; Package: None; Value: *; MP: RA-02; Check_prices: https://www.snapeda.com/parts/RA-02/AI-Thinker/view-part/?ref=eda; LCSC Part Number: C90039
U2 = ESP32-C3-MINI-1-H4: Multiprotocol Modules SMD module, ESP32-C3FH4, PCB antenna, -40 C +105 C; Manufacturer: Espressif Systems; Interface: 40Interface; Current - Receiving: 84mA; Current - Transmitting: 350mA; Data Rate: 150Mbps; Max Frequency: 2.484GHz; Max Supply Voltage: 3.6V; Min Supply Voltage: 3V; Number of GPIO: 13NUMBER; Supplier 1: Digikey; Manufacturer Part Number: ESP32-C3-MINI-1-H4; RoHS: No; Category: RF Receivers, Transceivers; Stock 1: 15506; Pricing 1: 1=3,28, 10=2,836, 25=2,6796, 100=2,4652, 250=2,33652 (USD); Min Operating Temperature: -40°C; Max Operating Temperature: 85°C; Height: 2.55mm; Supplier Part Number 1: 5407-ESP32-C3-MINI-1-H4CT-ND; LCSC Part Number: C2934569
U3-U6 = PC817X2NIP1B: Optocoupler DC-IN 1-CH Transistor DC-OUT 4-Pin DIP SMD T/R; MF: Sharp Microelectronics; SnapEDA_Link: https://www.snapeda.com/parts/PC817X2NIP1B/Sharp+Microelectronics/view-part/?ref=snap; Package: SMD-4 Sharp Microelectronics; Value: *; MP: PC817X2NIP1B; Check_prices: https://www.snapeda.com/parts/PC817X2NIP1B/Sharp+Microelectronics/view-part/?ref=eda
U9 = BQ24040DSQR: Standalone 1-cell 1-A linear battery charger with 4.2-V VBAT and Temperature Sensing; MF: Texas Instruments; SnapEDA_Link: https://www.snapeda.com/parts/BQ24040DSQR/Texas+Instruments/view-part/?ref=snap; Package: WSON-10 Texas Instruments; Value: *; MP: BQ24040DSQR; Check_prices: https://www.snapeda.com/parts/BQ24040DSQR/Texas+Instruments/view-part/?ref=eda; LCSC Part Number: C81080
VR1 = TPS7A9201DSKR: 2-A, low-noise, high-PSRR, adjustable ultra-low-dropout voltage regulator with high-accuracy; Price: None; MP: TPS7A9201DSKR; Availability: Unavailable; Package: None; Value: *; LCSC Part Number: C882405
D6-D8 D11 = 1N4007FLTR: Package: None; Price: None; Value: *; MP: 1N4007FLTR; Availability: Unavailable
R9 = RT0402BRD073K57L: SnapEDA_Link: https://www.snapeda.com/parts/RT0402BRD073K57L/Yageo/view-part/?ref=snap; Check_prices: https://www.snapeda.com/parts/RT0402BRD073K57L/Yageo/view-part/?ref=eda; LCSC Part Number: C852766